# Altium project RX_Board.PrjPcb (part 5 of 5)
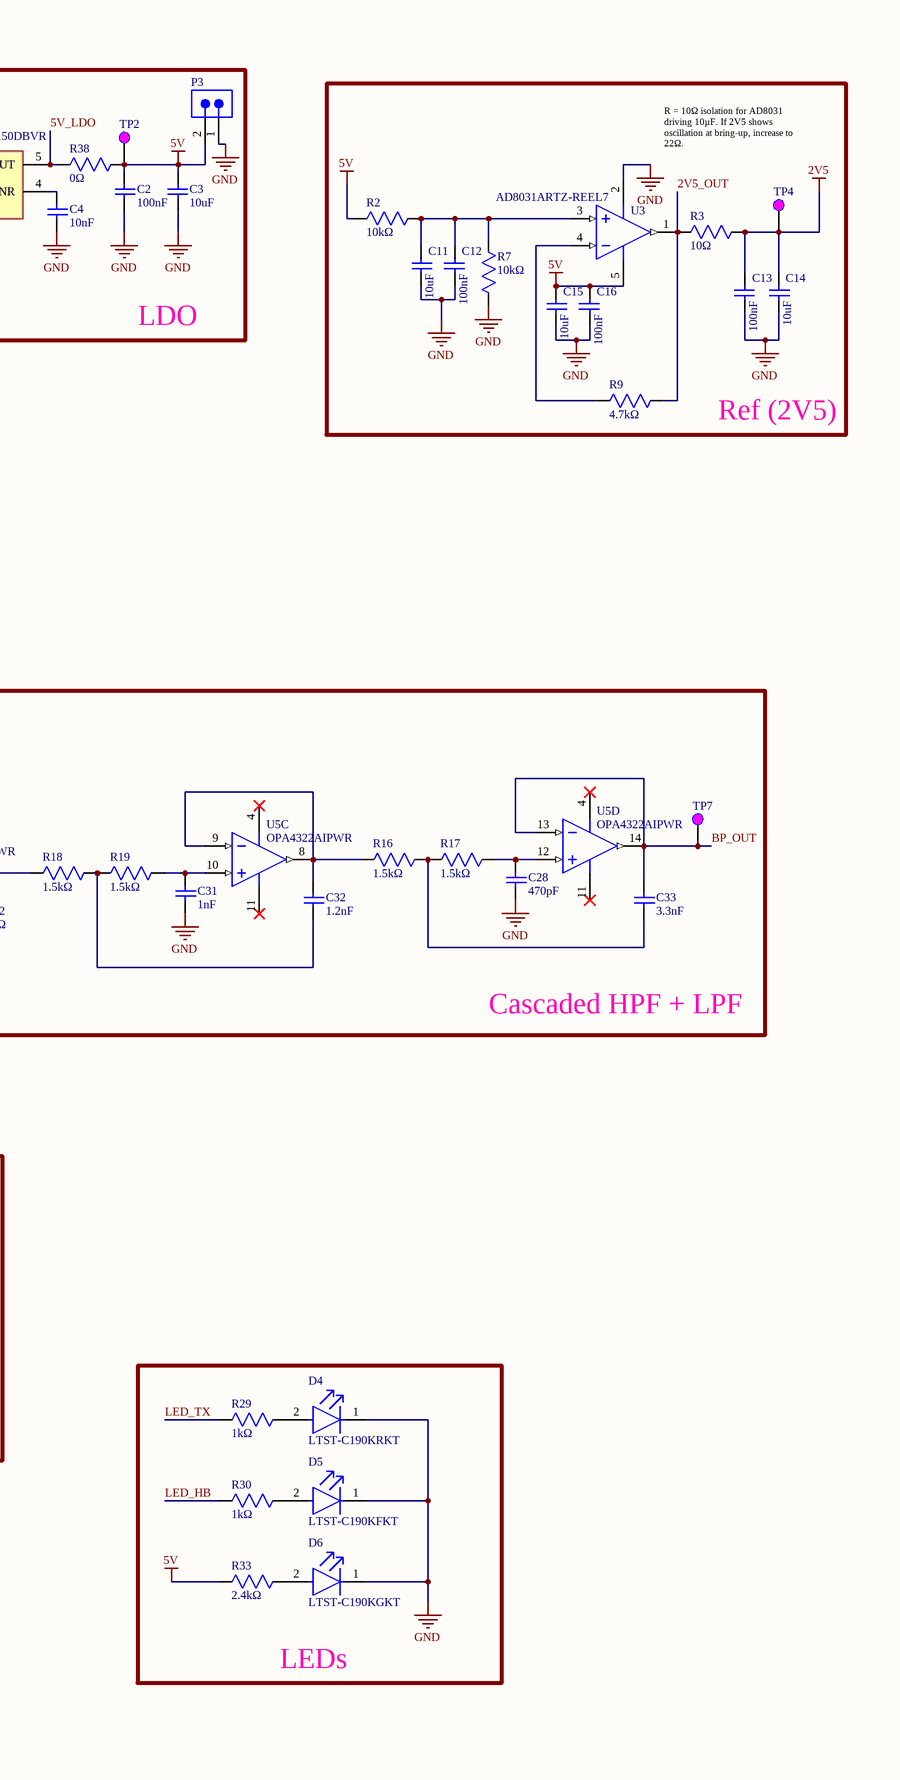
[diagram p5: RX_Board.SchDoc, right]

## Sheet RX_Board.SchDoc (continued)

### Library data of the parts (continued)
U10 = CMP-0054-00266-2: Single Channel, 0.5 to 1 MSPS, 12-Bit A/D Converter, 6-pin SOT-23, Pb-Free; Manufacturer: National Semiconductor; PackageTopMarking: X01C*XTT; PowerWise: Y; CompType: ADC IC; RevisionNote: Component URLs added; ComponentLink1URL: http://www.national.com/ds/AD/ADC121S101.pdf; RoHS: Y; ComponentLink2Description: ADC121S101 Web Page; DatasheetVersion: Jun-2004; PackageVersion: revC, Sep-2005; PinCount: 6; PackageDescription: Molded SOT-23, .115 x .063 x .040in Body, 6 Lead, .0375in in Pitch; Code_IPC: SOT26A-6; ComponentLink2URL: http://www.national.com/pf/AD/ADC121S101.html; PackageReference: MF06A; ComponentLink1Description: ADC121S101 Datasheet; ComponentLink3URL: http://www.national.com/packaging/folders/mf06a.html; ComponentLink3Description: MF06A Package Page; Code_JEDEC: MO-178-AB; JLCPCB Part Number: C74860

## Assembly variants
JLCPCB Assembly: not fitted J2 J? MD1 U?